# EAGLE design EMS esp32 LoRa (EAGLE 9.5.2)
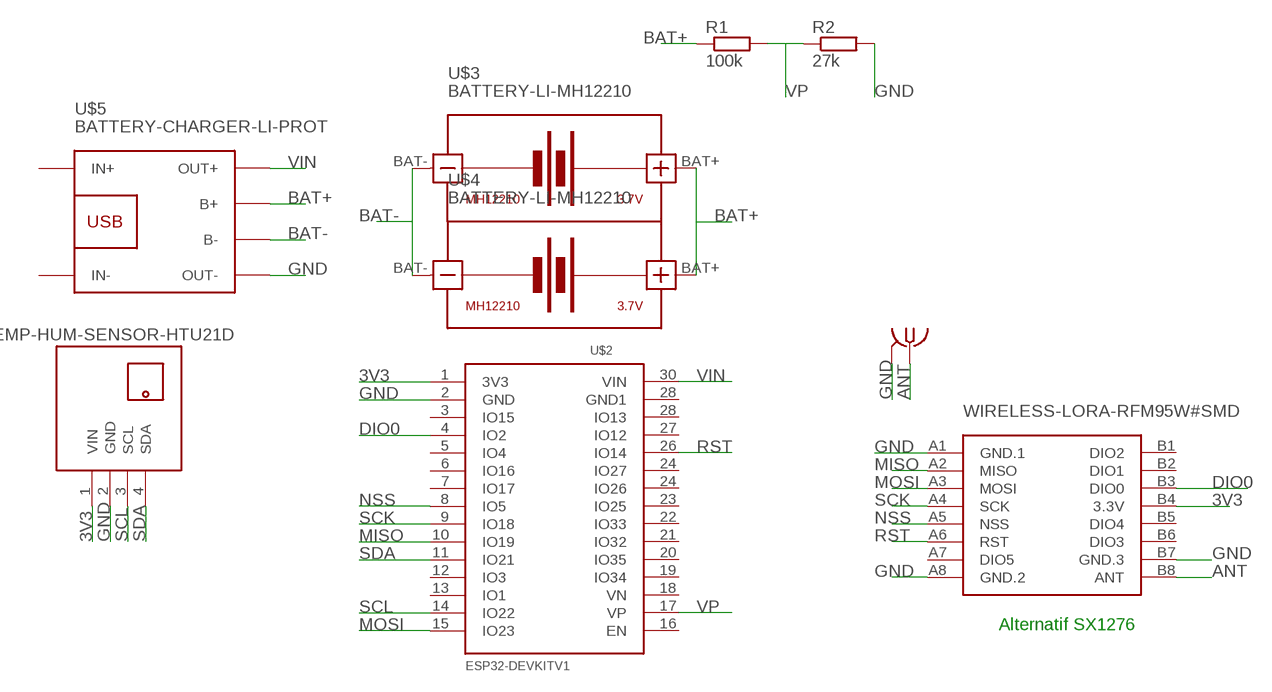
[diagram p0: schematic, sheet 1]

## Parts
R1  100k  R-EU_0204/7  [0204/7]
R2  27k  R-EU_0204/7  [0204/7]
U$1  WIRELESS-LORA-RFM95W#SMD  [WIRELESS-LORA-RFM95W#SMD]
U$2  ESP32DEVKITV1  [ESP32-DEVKITV1]
U$3  BATTERY-LI-MH12210  [BATTERY-LI-MH12210]
U$4  BATTERY-LI-MH12210  [BATTERY-LI-MH12210]
U$5  BATTERY-CHARGER-LI-PROT  [BATTERY-CHARGER-LI-PROT]
U$6  TEMP-HUM-SENSOR-HTU21D  [TEMP-HUM-SENSOR-HTU21D]
X1  SMA-142-0701-801/806  [J502-ND-142-0701-801/806]

## Nets
3V3: U$1.B4(3.3V) U$2.1(3V3) U$6.1(VIN)
ANT: U$1.B8(ANT) X1.1
BAT+: R1.1 U$3.BAT+ U$4.BAT+ U$5.B+
BAT-: U$3.BAT- U$4.BAT- U$5.B-
DIO0: U$1.B3(DIO0) U$2.4(IO2)
GND: R2.2 U$1.A1(GND.1) U$1.A8(GND.2) U$1.B7(GND.3) U$2.2(GND) U$5.OUT- U$6.2(GND) X1.G@1 X1.G@2 X1.G@3 X1.G@4
MISO: U$1.A2(MISO) U$2.10(IO19)
MOSI: U$1.A3(MOSI) U$2.15(IO23)
NSS: U$1.A5(NSS) U$2.8(IO5)
RST: U$1.A6(RST) U$2.26(IO14)
SCK: U$1.A4(SCK) U$2.9(IO18)
SCL: U$2.14(IO22) U$6.3(SCL)
SDA: U$2.11(IO21) U$6.4(SDA)
VIN: U$2.30(VIN) U$5.OUT+
VP: R1.2 R2.1 U$2.17(VP)
Unconnected: U$1.A7(DIO5) U$1.B1(DIO2) U$1.B2(DIO1) U$1.B5(DIO4) U$1.B6(DIO3) U$2.3(IO15) U$2.5(IO4) U$2.6(IO16) U$2.7(IO17) U$2.12(IO3) U$2.13(IO1) U$2.16(EN) U$2.18(VN) U$2.19(IO34) U$2.20(IO35) U$2.21(IO32) U$2.22(IO33) U$2.23(IO25) U$2.24(IO26) U$2.24(IO27) U$2.27(IO12) U$2.28(GND1) U$2.28(IO13) U$5.IN+ U$5.IN-

## Notes on the sheet
- Alternatif SX1276

## Library data of the parts
R1 R2 = rcl:R-EU_: RESISTOR, European symbol; SPICEPREFIX: R
U$1 = diy-modules:WIRELESS-LORA-RFM95W: 868/915 MHz LoRa Radio Transceiver Module based on SX1276 chip Click here to find device on ebay.com <http://www.ebay.com/sch/RFM95W+transceiver>
U$2 = ESP32-DEVKITV1:ESP32DEVKITV1
U$3 U$4 = diy-modules:BATTERY-LI-MH12210: Lithium-Ion MH12210 Rechargeable Battery Panasonic NCR18650PF battery datasheet available here: https://industrial.panasonic.com/cdbs/www-data/pdf2/ACI4000/ACI4000C12.pdf Click here to find device on ebay.com <http://www.ebay.com/sch/ncr18650b+battery>
U$5 = diy-modules:BATTERY-CHARGER-LI-PROT: Lithium Battery 5V Charger with protection circuit More details available here: http://www.instructables.com/id/DIY-Lithium-ion-Battery-Charger/step4/TP4056-based-lithium-ion-battery-charger-module/ Click here to find device on ebay.com <http://www.ebay.com/sch/tp4056+charger+usb+protection>
U$6 = diy-modules:TEMP-HUM-SENSOR-HTU21D: Digital Humidity & Temperature Sensor based on HTU21D device More information about HTU21D device is available here: http://futureeverything.org/wp-content/uploads/2014/05/Humidity-Datasheet.pdf HTU21D Arudino Library is available here: https://learn.sparkfun.com/tutorials/htu21d-humidity-sensor-hookup-guide/htu21d-library-and-functions Click here to find device on ebay.com <http://www.ebay.com/sch/htu21d+board>
X1 = con-coax:SMA-: SMA 50 Ohm End Launch Jack Receptacle - Round Contact Johnson Components Source: www.johnsoncomponents.com .. J502-ND.pdf; MF: JOHNSON COMPONENTS; MPN: 142-0701-801; OC_FARNELL: 1608592; OC_NEWARK: 90F2624

## Board
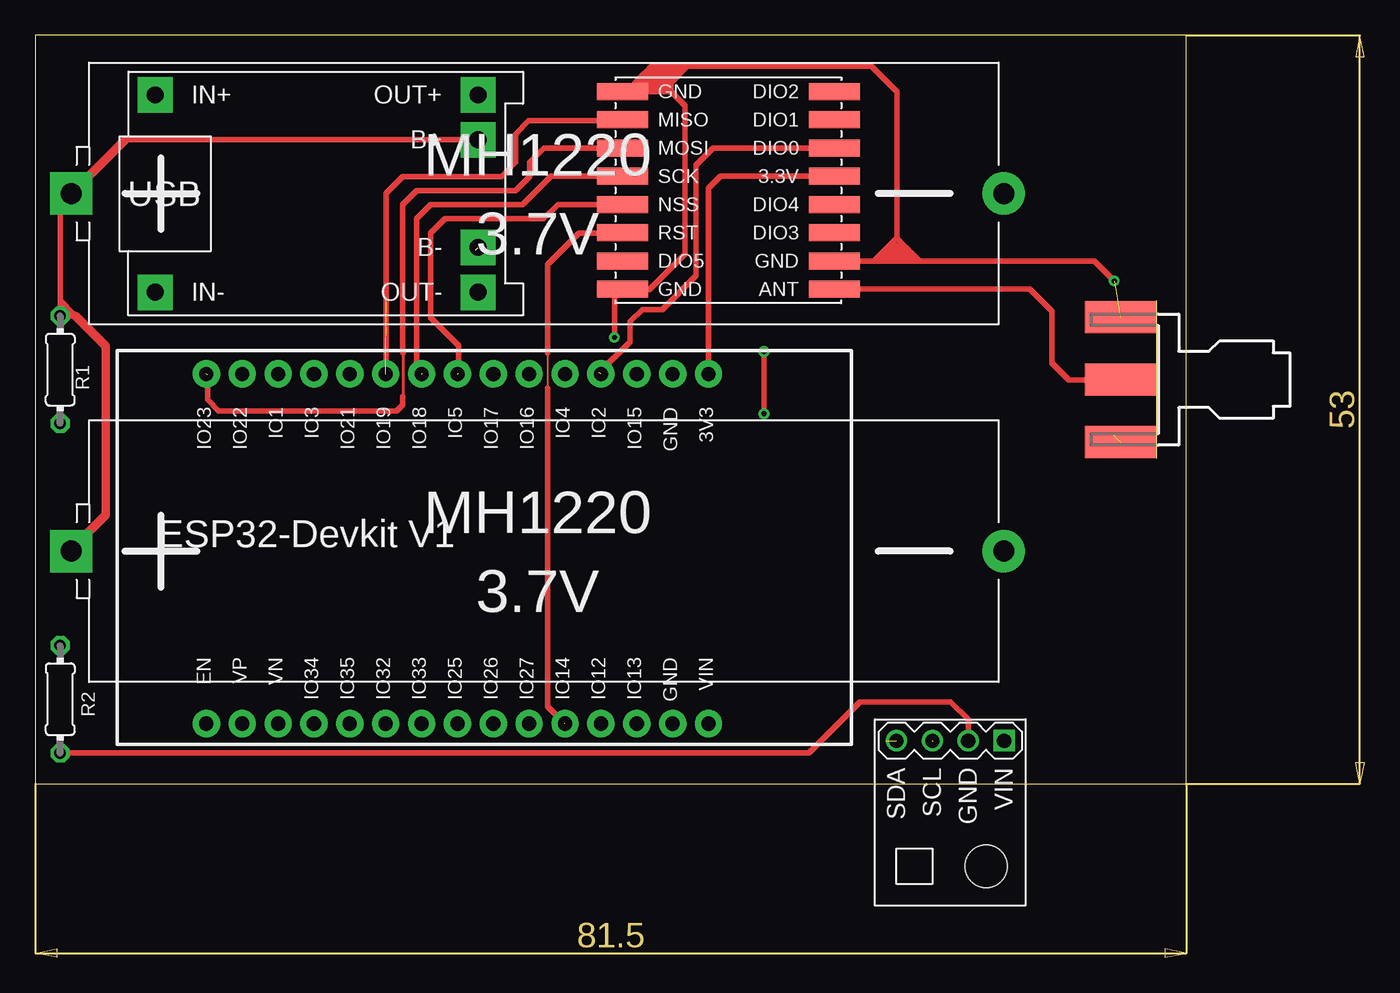
[diagram p1: board, top side]
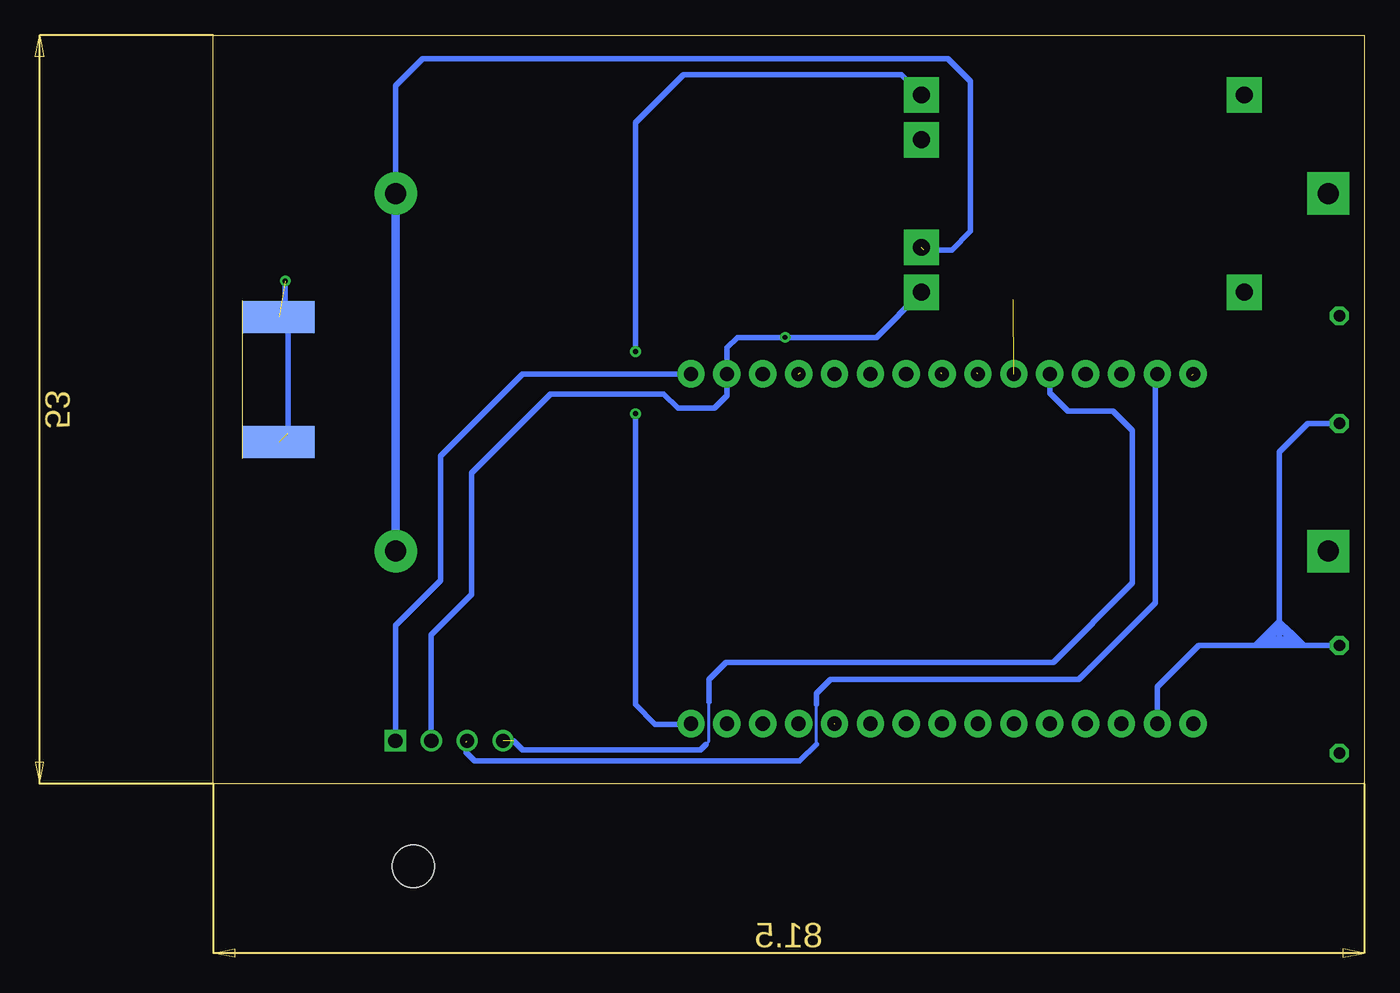
[diagram p2: board, bottom side, seen from below]

Size 81.5 x 53 mm. Coordinates in mm from the lower left corner, seen from the top.
Outline: 0,0 81.5,0 81.5,53 0,53 0,0
Copper layers (1*16): Top 0.035mm / dielectric 1.5mm / Bottom 0.035mm
Design rules "default": minimum track width 6mil, minimum drill 0.35mm, track to track 6mil, track to pad 6mil, pad to pad 6mil, via to via 6mil, smd to smd 6mil, copper to edge 40mil, drill to drill 6mil, minimum pad ring 10mil, minimum via ring 8mil, stop-mask expansion 4mil, vias tented up to drill 0mil, thermal gap 10mil

### Footprints (pad centres in the part's own frame; a part is rotated, then mirrored left to right if it is on the bottom)
0204/7 = drill 0.813 octagon: 1 -3.81,0; 2 3.81,0
WIRELESS-LORA-RFM95W#SMD = smd 3.6 x 1.2: A1 -7.5,7; A2 -7.5,5; A3 -7.5,3; A4 -7.5,1; A5 -7.5,-1; A6 -7.5,-3; A7 -7.5,-5; A8 -7.5,-7; B1 7.5,7; B2 7.5,5; B3 7.5,3; B4 7.5,1; B5 7.5,-1; B6 7.5,-3; B7 7.5,-5; B8 7.5,-7
ESP32-DEVKITV1 = drill 1 pad 1.93: 1 -22.87,-13.54; 2 -20.33,-13.54; 3 -17.79,-13.54; 4 -15.25,-13.54; 5 -12.71,-13.54; 6 -10.17,-13.54; 7 -7.63,-13.54; 8 -5.09,-13.54; 9 -2.55,-13.54; 10 -0.01,-13.54; 11 2.53,-13.54; 12 5.07,-13.54; 13 7.61,-13.54; 14 10.15,-13.54; 15 12.69,-13.54; 16 12.69,11.23; 17 10.15,11.23; 18 7.61,11.23; 19 5.07,11.23; 20 2.53,11.23; 21 -0.01,11.23; 22 -2.55,11.23; 23 -5.09,11.23; 24 -7.63,11.23; 25 -10.17,11.23; 26 -12.71,11.23; 27 -15.25,11.23; 28 -17.79,11.23; 29 -20.33,11.23; 30 -22.87,11.23
BATTERY-LI-MH12210 = drill 1.5 pad 3 square: BAT+ -33.02,0 | drill 1.5 pad 3: BAT- 33.02,0
BATTERY-CHARGER-LI-PROT = drill 1.2 pad 2.5 square: B+ 10.795,3.81; B- 10.795,-3.81; IN+ -12.065,6.985; IN- -12.065,-6.985; OUT+ 10.795,6.985; OUT- 10.795,-6.985
TEMP-HUM-SENSOR-HTU21D = drill 1 square: 1 -5.08,3.81 | drill 1: 2 -5.08,1.27; 3 -5.08,-1.27; 4 -5.08,-3.81 | hole 3: 3.81,2.54
J502-ND-142-0701-801/806 = smd 5.08 x 2.286: 1 2.565,0; G@1 2.565,4.42; G@2 2.565,-4.42 | smd 5.08 x 2.286 bottom: G@3 2.565,4.42; G@4 2.565,-4.42

### Placement (x,y rotation side)
R1  1.76,29.32 270 top
R2  1.76,5.98 270 top
U$1  49.08,42.02 0 top
U$2  24.8,15.48 180 top
U$3  35.56,16.47 0 top
U$4  35.56,41.79 0 top
U$5  20.56,41.79 0 top
U$6  64.79,-2.04 270 top
X1  79.41,28.62 180 top

### Tracks (layer width: path | path; a pad name or v marks a point on that pad's centre or on a via)
3V3
  Top 0.406: U$2.1 47.67,42.17 48.52,43.02 U$1.B4
  Bottom 0.406: U$2.1 59.58,29.02 65.4,23.2 65.4,14.4 68.6,11.2 U$6.1
ANT
  Top 0.406: U$1.B8 70.44,35.02 72,33.46 72,29.8 73.2,28.6 76.83,28.6 X1.1
BAT+
  Top 0.152: 2.59,16.61 U$3.BAT+
  Top 0.406: 1.76,33.6 R1.1 2.87,33.13 2.7,33.3 | 1.76,33.6 1.76,34.2 | 1.76,41.01 1.76,34.2 | 2.7,33.3 1.8,34.2 1.76,34.2 | 2.7,33.3 2.06,33.3 1.76,33.6 | 6.35,45.6 U$5.B+
  Top 0.61: 2.87,33.13 5,31 5,19.02 2.59,16.61 | 1.76,41.01 U$4.BAT+ 6.35,45.6
BAT-  (1 unrouted)
  Bottom 0.406: U$4.BAT- 68.58,49.42 66.67,51.34 29.46,51.34 27.87,49.74 27.87,39.13 29.2,37.8 31.18,37.8
  Bottom 0.61: U$4.BAT- U$3.BAT-
DIO0  (1 unrouted)
  Top 0.406: U$1.B3 56.56,45 48,45 46.8,43.8 46.8,35.98 44.41,33.59 42.99,33.59 42.11,32.71 42.11,31.29 39.93,29.11
GND  (via drill 0.35)  (4 unrouted)
  Top 0.406: U$1.A1 41.6,49 41.8,49 | 41.8,49 45,49 | 45,49 46,48 46,37.5 43.5,35 41.6,35 U$1.A8 41,34.44 v41,31.61 | v76.4,35.6 74.98,37.02 62.6,37.02 | U$1.B7 59.4,37.02 | 59.4,37.02 62.6,37.02 | 59.4,37.02 59.69,37.31 | 59.69,37.31 60.09,37.71 | 60.09,37.71 60.29,37.91 | 60.29,37.91 60.49,38.11 | 60.49,38.11 61,38.62 | 46.2,50.8 59.2,50.8 61,49 61,38.62 | 46.2,50.8 45.8,50.8 | 45.8,50.8 45.4,50.8 | 45.4,50.8 45,50.8 | 45,50.8 43.6,50.8 43.3,50.5 | 43.3,50.5 43,50.2 | 43,50.2 42.7,49.9 | 42.7,49.9 41.8,49 | 45,49.4 45,49.6 | 45,49.6 45,49.8 | 45,49.8 45,50.2 | 45,50.2 45,50.4 | 45,50.4 45,50.8 | 43,49.02 43.62,49.02 | 43.62,49.02 43.7,49.1 | 43.7,49.1 43.8,49.2 | 43.8,49.2 44.1,49.5 | 44.1,49.5 44.7,50.1 | 44.7,50.1 45,50.4 | 43.3,50.5 44.9,50.5 45,50.4 | 43,50.2 44.6,50.2 44.7,50.1 | 42.7,49.9 43,49.9 | 43,49.9 43.2,49.9 | 43.2,49.9 44.9,49.9 45,49.8 | 43.62,49.02 43.78,49.02 | 45,49.4 44.62,49.02 44.42,49.02 | 43.78,49.02 44.42,49.02 | 44.42,49.02 44.6,49.2 | 44.6,49.2 45,49.6 | 45,49.4 44.9,49.5 44.1,49.5 | 43.78,49.02 43.7,49.1 | 44.6,49.2 43.8,49.2 | 43.48,49.5 43.4,49.5 43,49.9 | 44.1,49.5 43.48,49.5 | 43.48,49.5 43,49.02 | U$1.A1 42.8,49.02 | 42.8,49.02 43,49.02 | 43.2,49.9 42.8,49.5 42.8,49.02 | U$1.A1 41.66,49.1 43.7,49.1 | 45,49 45,49.4 | 45,49.6 46.2,50.8 | 45.8,50.8 45.2,50.2 45,50.2 | 45.4,50.8 45,50.4 | 61,38.62 61.51,38.11 | 61.71,37.91 62.01,37.61 | 62.01,37.61 62.21,37.41 | 62.21,37.41 62.6,37.02 | 59.69,37.31 62.11,37.31 62.21,37.41 | 62.01,37.61 60.19,37.61 60.09,37.71 | 60.49,38.11 61.51,38.11 | 61.51,38.11 61.71,37.91 | 61.71,37.91 60.29,37.91 | R2.2 54.77,2.17 58.4,5.8 64.8,5.8 66.06,4.54 U$6.2
  Bottom 0.152: 45.11,29.11 U$2.2
  Bottom 0.406: 45.11,29.11 45.11,30.89 44.39,31.61 v41,31.61 34.55,31.61 U$5.OUT- | v76.4,35.6 76.4,33.2 76.2,33 76.2,24.84 | U$6.2 66.06,10.54 63.2,13.4 63.2,22 57.6,27.6 49.6,27.6 48.6,26.6 46,26.6 45.13,27.47 U$2.2
MISO  (1 unrouted)
  Top 0.152: 37.5,46.94 37.49,46.94 | 24.84,34.29 24.84,29.11 24.82,29.06
  Top 0.406: U$1.A2 41.5,46.94 37.5,46.94 | 37.49,46.94 34.94,46.94 34,46 34,44 33,43 26,43 24.82,41.83 24.82,29.06
MOSI  (1 unrouted)
  Top 0.203: 26.06,30.5 26.06,27.46 26,27.4
  Top 0.406: U$1.A3 36.02,45.02 35,44 35,43 34,42 27,42 26,41 26,30.56 26.06,30.5 | 12.2,28.93 12.2,27.2 13,26.4 25.6,26.4 26,26.8 26,27.4
NSS  (1 unrouted)
  Top 0.406: U$1.A5 41.56,41 37,41 36,40 29,40 28,39 28,33 29.96,31.04 29.96,29.07
RST  (1 unrouted)
  Top 0.152: 36.27,30.5 36.27,28
  Top 0.406: U$1.A6 41.56,39 38.5,39 36.27,36.77 36.27,30.5 | 37.49,4.27 36.27,5.49 36.27,28
SCK  (1 unrouted)
  Top 0.406: U$1.A4 36.52,43.02 34.5,41 28,41 27,40 27,29.49 27.41,29.08
SCL  (1 unrouted)
  Bottom 0.152: 14.78,28.96 U$2.14
  Bottom 0.203: 38.8,2.8 38.8,5.6
  Bottom 0.406: U$2.14 14.8,28.87 14.8,12.8 20.2,7.4 37.8,7.4 38.8,6.4 38.8,5.6 | 38.8,2.8 40,1.6 63,1.6 63.6,2.2 63.6,2.96
SDA  (1 unrouted)
  Bottom 0.152: 22.4,28.96 U$2.11
  Bottom 0.203: 46.6,2.8 46.4,3 46.4,5.8
  Bottom 0.406: 60.24,3.04 59.6,2.4 47,2.4 46.6,2.8 | 46.4,5.8 46.4,7.4 45.2,8.6 22,8.6 16.4,14.2 16.4,25 17.8,26.4 21,26.4 22.27,27.67 U$2.11
VIN  (via drill 0.35)
  Top 0.406: v51.6,30.6 v51.6,26.2
  Bottom 0.406: v51.6,30.6 51.6,46.8 48.2,50.2 32.78,50.2 U$5.OUT+ | v51.6,26.2 51.6,5.6 50.2,4.2 47.72,4.2 U$2.30
VP
  Bottom 0.152: 1.83,25.45 R1.2 | 1.83,9.91 R2.1
  Bottom 0.406: 4.79,9.79 6,9.79 | 6,9.79 7.21,9.79 | 7.71,9.79 11.71,9.79 14.65,6.85 U$2.17 | 6,11.5 6,23.5 3.99,25.51 R1.2 | 6,11.5 6,11 | 6,11 6,9.79 | 6,11 5.25,10.25 | 5.25,10.25 5,10 | 5,10 4.79,9.79 | 4.79,9.79 4.29,9.79 | 6,11.5 5.25,10.75 | 5.25,10.75 4.29,9.79 | 6,11.5 7.71,9.79 | 6,11 6.25,10.75 | 7,10 7.21,9.79 | 7.21,9.79 7.71,9.79 | 5.25,10.25 6.75,10.25 | 6.75,10.25 7,10 | 5,10 7,10 | 5.25,10.75 6.25,10.75 | 6.25,10.75 6.75,10.25 | R2.1 4.29,9.79